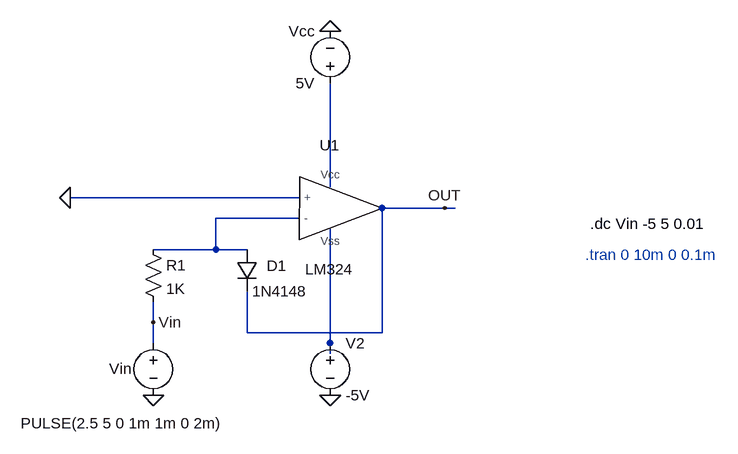
[diagram p0: schematic BAI 6 THUC HANH 2.asc]
BAI 6 THUC HANH 2.asc, the LTspice schematic file:
Version 4.1
SHEET 1 880 680
WIRE 144 128 144 -32
WIRE 96 144 -256 144
WIRE 320 160 224 160
WIRE 336 160 320 160
WIRE 96 176 -32 176
WIRE -32 224 -32 176
WIRE -32 224 -128 224
WIRE 16 224 -32 224
WIRE -128 336 -128 304
WIRE 16 352 16 288
WIRE 224 352 224 160
WIRE 224 352 16 352
WIRE -128 368 -128 336
WIRE 144 368 144 192
WIRE 144 384 144 368
FLAG 144 -112 0
FLAG 320 160 OUT
FLAG -128 448 0
FLAG -256 144 0
FLAG -128 336 Vin
FLAG 144 448 0
SYMBOL LM324 144 160 R0
SYMATTR InstName U1
SYMBOL voltage 144 -16 R180
WINDOW 0 24 96 Left 2
WINDOW 3 24 16 Left 2
SYMATTR InstName Vcc
SYMATTR Value 5V
SYMBOL voltage 144 352 R0
SYMATTR InstName V2
SYMATTR Value -5V
SYMBOL diode 0 224 R0
WINDOW 0 46 25 Left 2
SYMATTR InstName D1
SYMATTR Value 1N4148
SYMBOL res -144 208 R0
SYMATTR InstName R1
SYMATTR Value 1K
SYMBOL voltage -128 352 R0
WINDOW 0 -68 55 Left 2
WINDOW 3 -204 139 Left 2
WINDOW 123 -62 182 Left 2
WINDOW 39 0 0 Left 0
SYMATTR InstName Vin
SYMATTR Value PULSE(2.5 5 0 1m 1m 0 2m)
TEXT 536 232 Left 2 ;.tran 0 10m 0 0.1m
TEXT 544 184 Left 2 !.dc Vin -5 5 0.01

The netlist it stands for:
* BAI 6 THUC HANH 2.asc
X§U1 0 N002 N001 N003 OUT LM324  ; pins + - Vcc Vss ?
Vcc N001 0 5V
V2 N003 0 -5V
D1 N002 OUT 1N4148
R1 N002 Vin 1K
Vin Vin 0 PULSE(2.5 5 0 1m 1m 0 2m)
.model D D
.lib standard.dio
* .tran 0 10m 0 0.1m
.dc Vin -5 5 0.01
.lib E:\ThiThucHanhCoHa\CoHa\LM324.cir
.backanno
.end